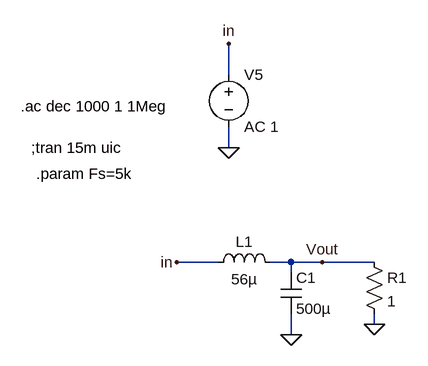
[diagram p0: schematic Buck_AC.asc]
Buck_AC.asc, the LTspice schematic file:
Version 4
SHEET 1 1764 1252
WIRE 1120 -32 1120 -80
WIRE 1120 80 1120 48
WIRE 1104 256 1040 256
WIRE 1216 256 1184 256
WIRE 1264 256 1216 256
WIRE 1344 256 1264 256
WIRE 1216 272 1216 256
WIRE 1344 352 1344 336
WIRE 1216 368 1216 336
FLAG 1216 368 0
FLAG 1344 352 0
FLAG 1264 256 Vout
FLAG 1120 80 0
FLAG 1120 -80 in
FLAG 1040 256 in
SYMBOL ind 1088 272 R270
WINDOW 0 32 56 VTop 2
WINDOW 3 5 56 VBottom 2
SYMATTR InstName L1
SYMATTR Value 56µ
SYMBOL cap 1200 272 R0
SYMATTR InstName C1
SYMATTR Value 500µ
SYMBOL res 1328 240 R0
SYMATTR InstName R1
SYMATTR Value 1
SYMBOL voltage 1120 -48 R0
WINDOW 123 0 0 Left 0
WINDOW 39 0 0 Left 0
SYMATTR InstName V5
SYMATTR Value AC 1
TEXT 816 80 Left 2 !;tran 15m uic
TEXT 824 120 Left 2 !.param Fs=5k
TEXT 800 16 Left 2 !.ac dec 1000 1 1Meg

The netlist it stands for:
* Buck_AC.asc
L1 in Vout 56µ
C1 Vout 0 500µ
R1 Vout 0 1
V5 in 0 AC 1
;tran 15m uic
.param Fs=5k
.ac dec 1000 1 1Meg
.backanno
.end